# EAGLE design PRIMERAPRUEBA (EAGLE 9.6.2)
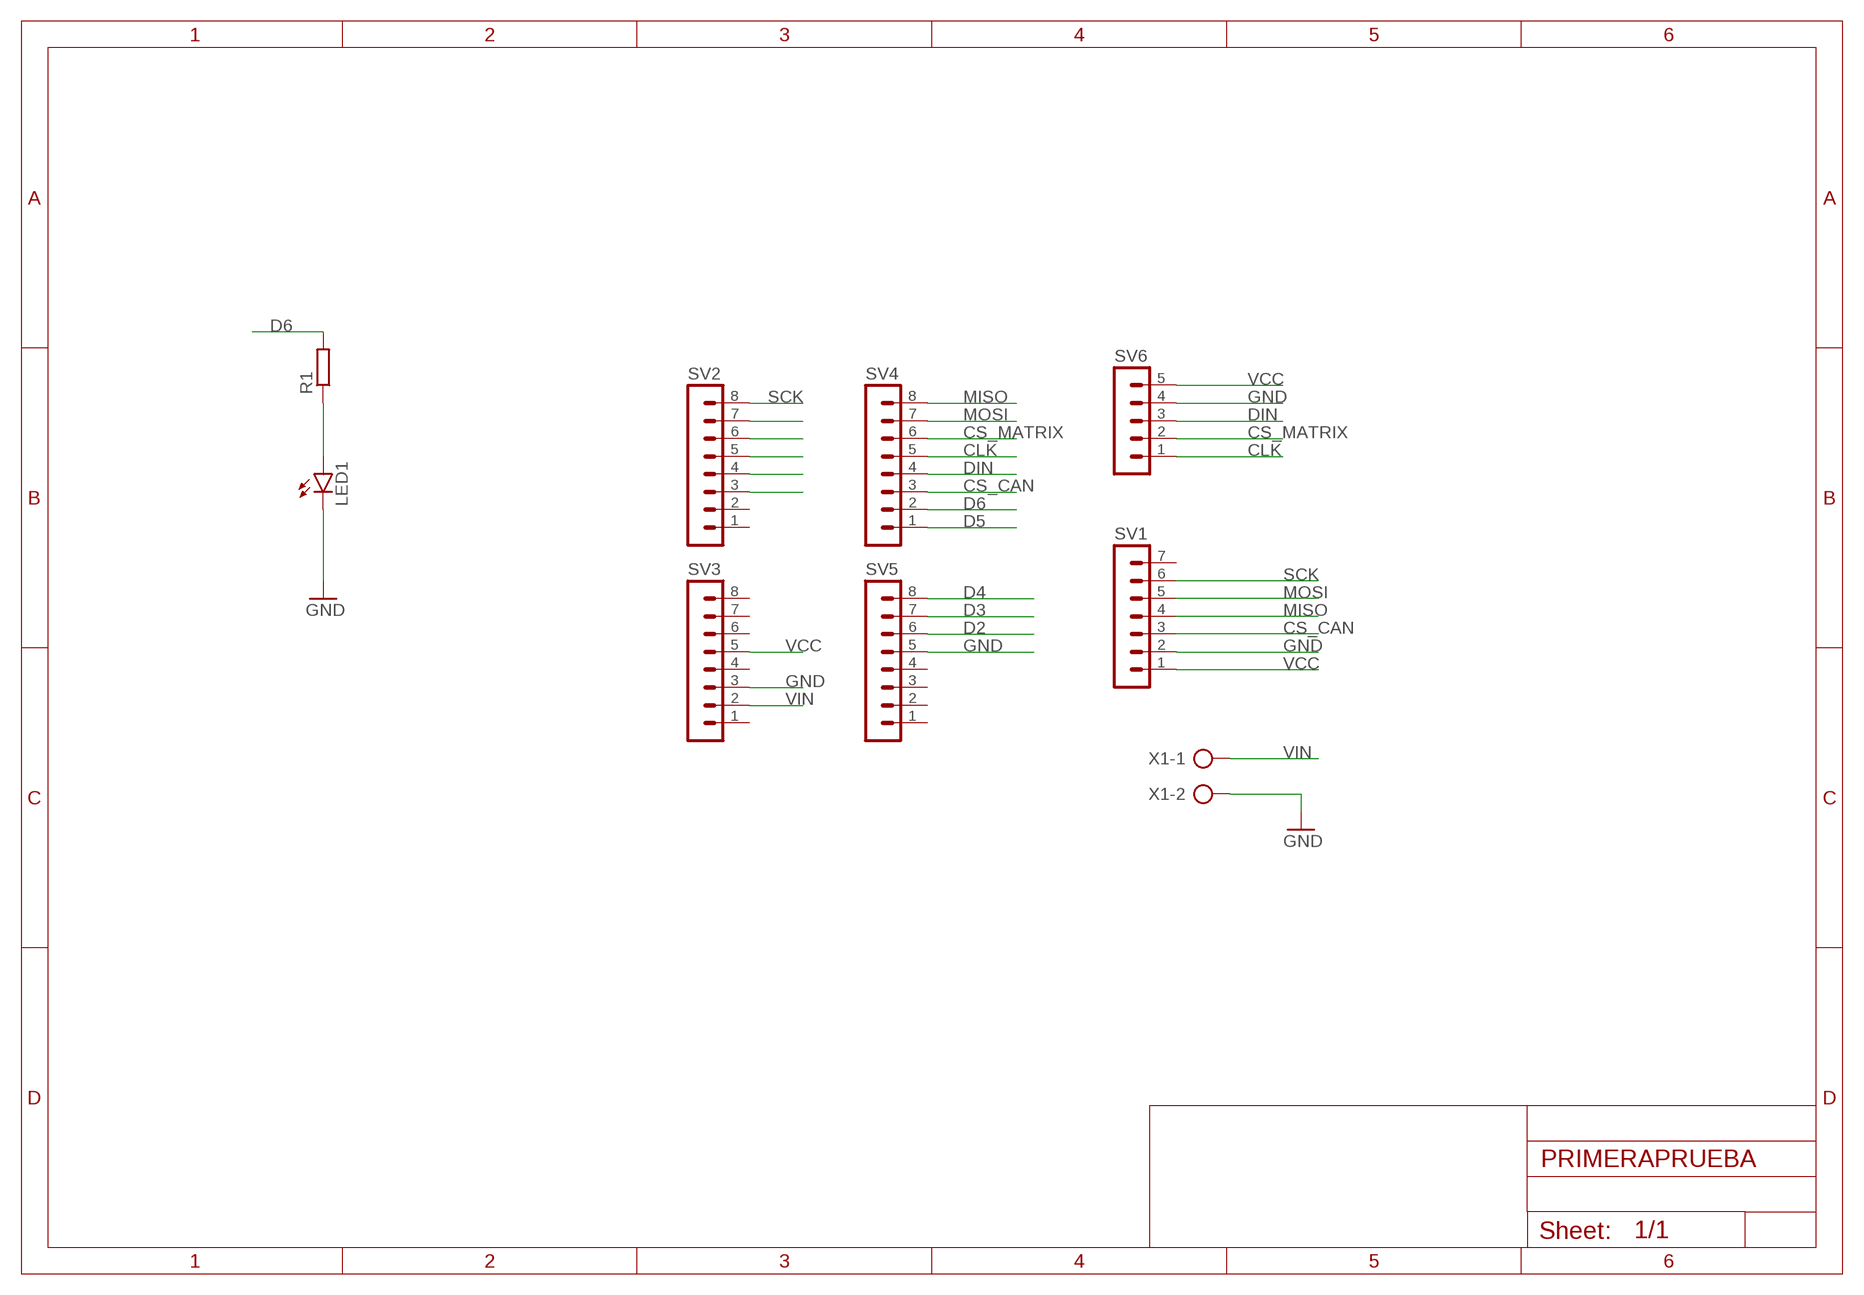
[diagram p0: schematic, sheet 1]

## Parts
LED1  LED5MM  [LED5MM]
R1  R-EU_0204/7  [0204/7]
SV1  MA07-1  [MA07-1]
SV2  MA08-1  [MA08-1]
SV3  MA08-1  [MA08-1]
SV4  MA08-1  [MA08-1]
SV5  MA08-1  [MA08-1]
SV6  MA05-1  [MA05-1]
X1  AK300/2  [AK300/2]

## Nets
CLK: SV4.5 SV6.1
CS_CAN: SV1.3 SV4.3
CS_MATRIX: SV4.6 SV6.2
D2: SV5.6
D3: SV5.7
D4: SV5.8
D5: SV4.1
D6: R1.2 SV4.2
DIN: SV4.4 SV6.3
GND: LED1.K(C) SV1.2 SV3.3 SV5.5 SV6.4 X1.2
MISO: SV1.4 SV4.8
MOSI: SV1.5 SV4.7
N$1: LED1.A R1.1
N$2: SV2.7
N$3: SV2.6
N$4: SV2.5
N$5: SV2.4
N$6: SV2.3
SCK: SV1.6 SV2.8
VCC: SV1.1 SV3.5 SV6.5
VIN: SV3.2 X1.1
Unconnected: SV1.7 SV2.1 SV2.2 SV3.1 SV3.4 SV3.6 SV3.7 SV3.8 SV5.1 SV5.2 SV5.3 SV5.4

## Library data of the parts
LED1 = led:LED: LED OSRAM: - CHIPLED LG R971, LG N971, LY N971, LG Q971, LY Q971, LO R971, LY R971 LH N974, LH R974 LS Q976, LO Q976, LY Q976 LO Q996 - Hyper CHIPLED LW Q18S LB Q993, LB Q99A, LB R99A - SideLED LS A670, LO A670, LY A670, LG A670, LP A670 LB A673, LV A673, LT A673, LW A673 LH A674 LY A675 LS A676, LA A676, LO A676, LY A676, LW A676 LS A679, LY A679, LG A679 - Hyper Micro SIDELED® LS Y876, LA Y876, LO Y876, LY Y876 LT Y87S - SmartLED LW L88C, LW L88S LB L89C, LB L89S, LG L890 LS L89K, LO L89K, LY L89K LS L896, LA L896, LO L896, LY L896 - TOPLED LS T670, LO T670, LY T670, LG T670, LP T670 LSG T670, LSP T670, LSY T670, LOP T670, LYG T670 LG T671, LOG T671, LSG T671 LB T673, LV T673, LT T673, LW T673 LH T674 LS T676, LA T676, LO T676, LY T676, LB T676, LH T676, LSB T676, LW T676 LB T67C, LV T67C, LT T67C, LS T67K, LO T67K, LY T67K, LW E67C LS E67B, LA E67B, LO E67B, LY E67B, LB E67C, LV E67C, LT E67C LW T67C LS T679, LY T679, LG T679 LS T770, LO T770, LY T770, LG T770, LP T770 LB T773, LV T773, LT T773, LW T773 LH T774 LS E675, LA E675, LY E675, LS T675 LS T776, LA T776, LO T776, LY T776, LB T776 LHGB T686 LT T68C, LB T68C - Hyper Mini TOPLED® LB M676 - Mini TOPLED Santana® LG M470 LS M47K, LO M47K, LY M47K Source: http://www.osram.convergy.de LUXEON: - LUMILED® LXK2-PW12-R00, LXK2-PW12-S00, LXK2-PW14-U00, LXK2-PW14-V00 LXK2-PM12-R00, LXK2-PM12-S00, LXK2-PM14-U00 LXK2-PE12-Q00, LXK2-PE12-R00, LXK2-PE12-S00, LXK2-PE14-T00, LXK2-PE14-U00 LXK2-PB12-K00, LXK2-PB12-L00, LXK2-PB12-M00, LXK2-PB14-N00, LXK2-PB14-P00, LXK2-PB14-Q00 LXK2-PR12-L00, LXK2-PR12-M00, LXK2-PR14-Q00, LXK2-PR14-R00 LXK2-PD12-Q00, LXK2-PD12-R00, LXK2-PD12-S00 LXK2-PH12-R00, LXK2-PH12-S00 LXK2-PL12-P00, LXK2-PL12-Q00, LXK2-PL12-R00 Source: www.luxeon.com KINGBRIGHT: KA-3528ASYC Source: www.kingbright.com
R1 = rcl:R-EU_: RESISTOR, European symbol; SPICEPREFIX: R
SV1 = con-lstb:MA07-1: PIN HEADER; OC_FARNELL: unknown; OC_NEWARK: unknown
SV2-SV5 = con-lstb:MA08-1: PIN HEADER; OC_FARNELL: unknown; OC_NEWARK: unknown
SV6 = con-lstb:MA05-1: PIN HEADER; OC_FARNELL: unknown; OC_NEWARK: unknown
X1 = con-ptr500:AK300/2: CONNECTOR; OC_FARNELL: unknown; OC_NEWARK: unknown

## Board
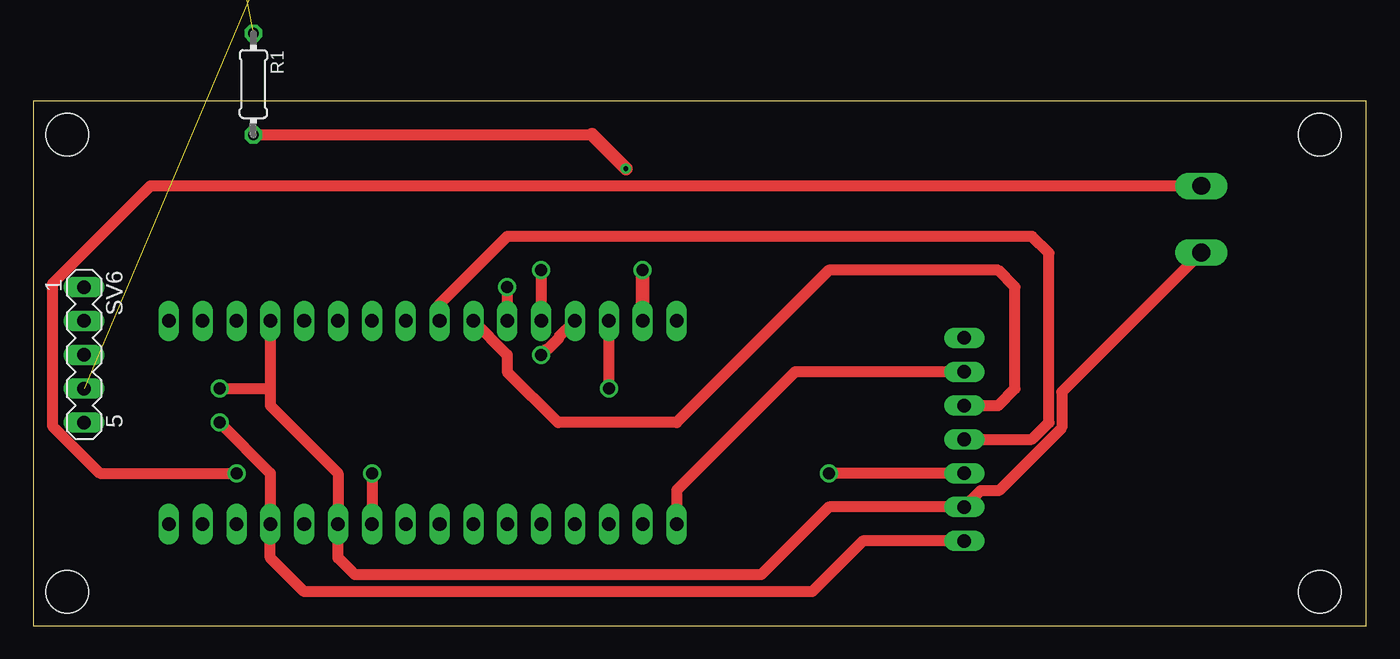
[diagram p1: board, top side]
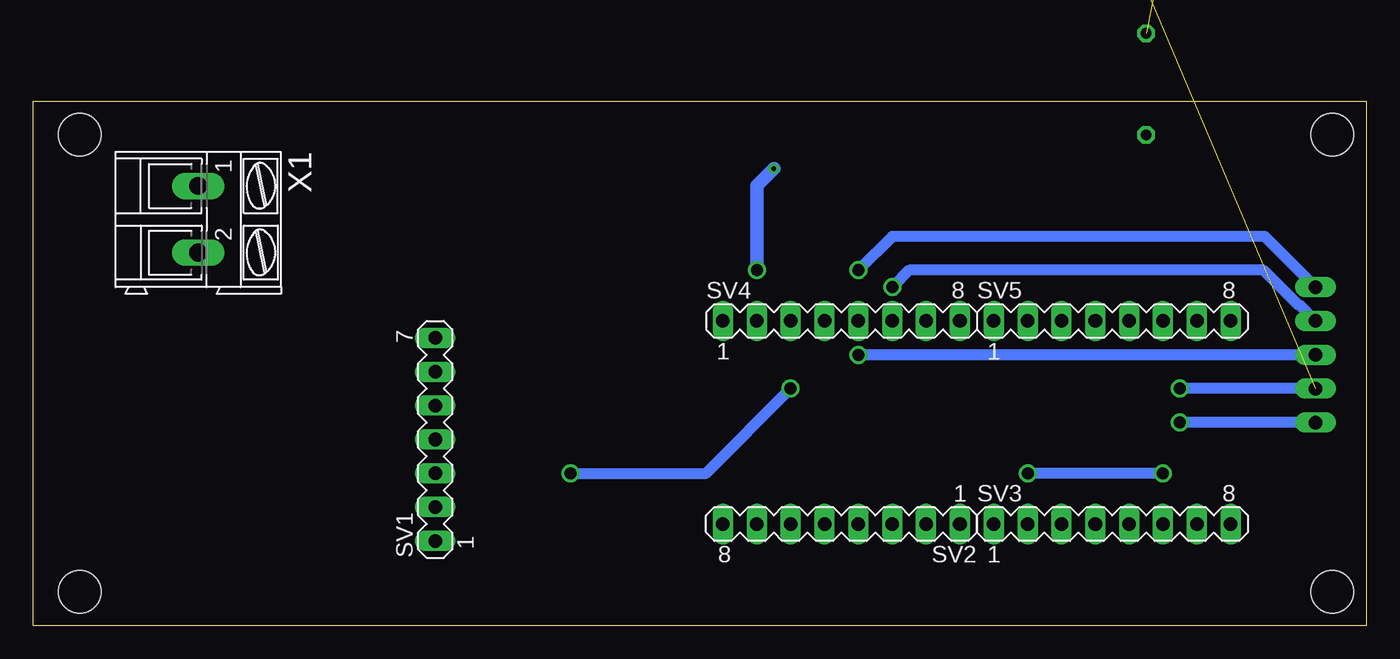
[diagram p2: board, bottom side, seen from below]

Size 100 x 39.36 mm. Coordinates in mm from the lower left corner, seen from the top.
Outline: 0,0 100,0 100,39.36 0,39.36 0,0
Copper layers (1*16): Top 0.035mm / dielectric 1.5mm / Bottom 0.035mm
Design rules "default": minimum track width 6mil, minimum drill 0.35mm, track to track 6mil, track to pad 6mil, pad to pad 6mil, via to via 6mil, smd to smd 6mil, copper to edge 40mil, drill to drill 6mil, minimum pad ring 10mil, minimum via ring 8mil, stop-mask expansion 4mil, vias tented up to drill 0mil, thermal gap 10mil
Holes 3.2 mm at 2.54,36.83 2.54,2.54 96.52,2.54 96.52,36.83

### Footprints (pad centres in the part's own frame; a part is rotated, then mirrored left to right if it is on the bottom)
LED5MM = drill 0.813 octagon: A -1.27,0; K 1.27,0
0204/7 = drill 0.813 octagon: 1 -3.81,0; 2 3.81,0
MA07-1 = drill 1.016 long: 1 -7.62,0; 2 -5.08,0; 3 -2.54,0; 4 0,0; 5 2.54,0; 6 5.08,0; 7 7.62,0
MA08-1 = drill 1.016 long: 1 -8.89,0; 2 -6.35,0; 3 -3.81,0; 4 -1.27,0; 5 1.27,0; 6 3.81,0; 7 6.35,0; 8 8.89,0
MA05-1 = drill 1.016 long: 1 -5.08,0; 2 -2.54,0; 3 0,0; 4 2.54,0; 5 5.08,0
AK300/2 = drill 1.321 long: 1 -2.515,0; 2 2.489,0

### Placement (x,y rotation side)
LED1  16.51,50.8 0 top  (outside the outline)
R1  16.51,40.64 270 top
SV1  69.85,13.97 90 bottom
SV2  39.37,7.62 180 bottom
SV3  19.05,7.62 0 bottom
SV4  39.37,22.86 0 bottom
SV5  19.05,22.86 0 bottom
SV6  3.81,20.32 270 top
X1  87.63,30.48 270 bottom

### Tracks (layer width: path | path; a pad name or v marks a point on that pad's centre or on a via)
CLK  (via drill 0.9)
  Top 0.813: v38.1,26.67 SV4.5
  Bottom 0.813: SV6.1 7.62,29.21 35.56,29.21 v38.1,26.67
CS_CAN  (via drill 0.9)
  Top 0.813: SV1.3 v59.69,11.43 | v43.18,17.78 SV4.3
  Bottom 0.813: v59.69,11.43 49.53,11.43 v43.18,17.78
CS_MATRIX  (via drill 0.9)
  Top 0.813: v35.56,25.4 SV4.6
  Bottom 0.813: v35.56,25.4 34.29,26.67 7.71,26.67 5.12,24.08 5.03,24.08 SV6.2
D6  (via drill 0.35, 0.9)
  Top 0.813: R1.2 41.91,36.83
  Top 1.016: 41.91,36.83 v44.45,34.29 | v45.72,26.67 SV4.2
  Bottom 1.016: v44.45,34.29 45.72,33.02 v45.72,26.67
DIN  (via drill 0.9)
  Top 0.813: v38.1,20.32 38.56,20.78 38.65,20.78 39.42,21.55 39.42,21.64 SV4.4
  Bottom 0.813: SV6.3 v38.1,20.32
GND  (via drill 0.9)  (1 unrouted)
  Top 0.813: SV5.5 17.78,17.78 | 17.78,17.78 17.78,16.51 22.86,11.43 SV3.3 22.86,5.08 24.13,3.81 54.61,3.81 59.69,8.89 SV1.2 71.07,10.11 72.43,10.11 77.17,14.84 77.17,17.53 X1.2 | v13.97,17.78 17.78,17.78
  Bottom 0.813: SV6.4 v13.97,17.78
MISO
  Top 0.813: SV1.4 74.93,13.97 76.2,15.24 76.2,27.94 74.93,29.21 35.56,29.21 30.48,24.13 SV4.8
MOSI
  Top 0.813: SV1.5 72.39,16.51 73.66,17.78 73.66,25.4 72.39,26.67 59.69,26.67 48.26,15.24 39.37,15.24 35.56,19.05 35.56,20.32 SV4.7
N$1  (1 unrouted)
SCK
  Top 0.813: SV2.8 48.26,10.16 57.15,19.05 SV1.6
VCC  (via drill 0.9)
  Top 0.813: SV1.1 62.23,6.35 58.42,2.54 20.32,2.54 17.78,5.08 SV3.5 17.78,11.43 v13.97,15.24
  Bottom 0.813: SV6.5 v13.97,15.24
VIN  (via drill 0.9)
  Top 0.813: X1.1 8.78,32.99 1.42,25.64 1.42,15 4.99,11.43 v15.24,11.43 | v25.4,11.43 SV3.2
  Bottom 0.813: v15.24,11.43 v25.4,11.43